# EAGLE schematic PIRprotov1 (EAGLE 7.2.0)
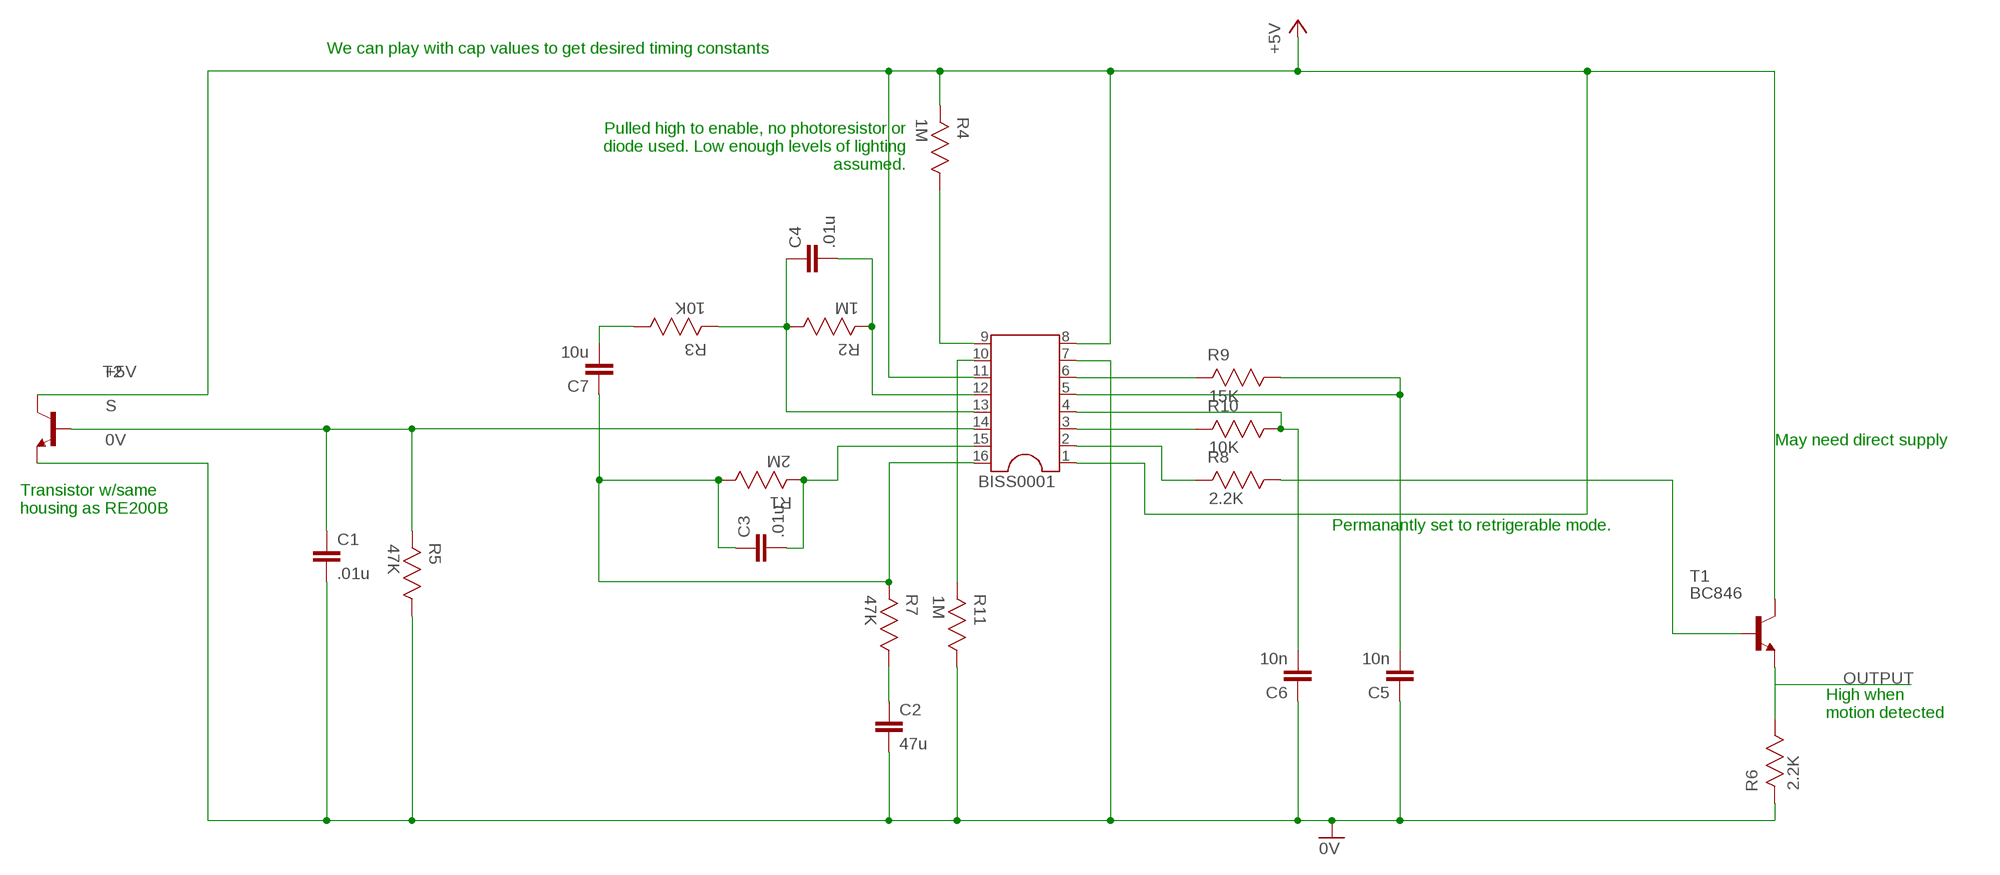
[diagram p0: schematic, sheet 1]

## Parts
BISS0001  DIL16S  [SOCKET-16]
C1  .01u  CAP0805  [0805]
C2  47u  CAP0805  [0805]
C3  .01u  CAP0805  [0805]
C4  .01u  CAP0805  [0805]
C5  10n  CAP0805  [0805]
C6  10n  CAP0805  [0805]
C7  10u  CAP0805  [0805]
R1  2M  0603RESISTOR1  [0603RESISTOR]
R2  1M  0603RESISTOR1  [0603RESISTOR]
R3  10K  0603RESISTOR1  [0603RESISTOR]
R4  1M  0603RESISTOR1  [0603RESISTOR]
R5  47K  0603RESISTOR1  [0603RESISTOR]
R6  2.2K  0603RESISTOR1  [0603RESISTOR]
R7  47K  0603RESISTOR1  [0603RESISTOR]
R8  2.2K  0603RESISTOR1  [0603RESISTOR]
R9  15K  0603RESISTOR1  [0603RESISTOR]
R10  10K  0603RESISTOR1  [0603RESISTOR]
R11  1M  0603RESISTOR1  [0603RESISTOR]
T1  BC846  [SOT23]
T2  -NPN-TO5  [TO5]

## Nets
0V: BISS0001.7 C1.2 C2.2 C5.1 C6.1 R5.1 R6.2 R11.1 T2.1(E)
+5V: BISS0001.1 BISS0001.8 BISS0001.11 R4.2 T1.3(C) T2.3(C)
N$1: BISS0001.16 C3.1 C7.1 R1.1 R7.2
N$2: BISS0001.15 C3.2 R1.2
N$3: C7.2 R3.1
N$4: BISS0001.13 C4.1 R2.1 R3.2
N$5: BISS0001.12 C4.2 R2.2
N$6: BISS0001.6 R9.2
N$7: BISS0001.5 C5.2 R9.1
N$8: C2.1 R7.1
N$9: BISS0001.9 R4.1
N$10: BISS0001.10 R11.2
N$11: BISS0001.4 C6.2 R10.1
N$12: BISS0001.3 R10.2
N$13: BISS0001.2 R8.2
N$15: R8.1 T1.1(B)
OUTPUT: R6.1 T1.2(E)
S: BISS0001.14 C1.1 R5.2 T2.2(B)

## Notes on the sheet
- We can play with cap values to get desired timing constants
- Pulled high to enable, no photoresistor or
   diode used. Low enough levels of lighting
   assumed.
- May need direct supply
- Transistor w/same 
  housing as RE200B
- Permanantly set to retrigerable mode.
- High when 
  motion detected

## Library data of the parts
BISS0001 = ic-package:DIL16: Dual In Line / Socket
C1-C7 = CharlieCreations:CAP: Capacitor Standard 0603 ceramic capacitor, and 0.1" leaded capacitor.
R1-R11 = CharlieCreations:0603RESISTOR: RESISTOR, 0603; MPN: CRCW06031K21FKEA; OC_FARNELL: 1652852; OC_NEWARK: 52K8027; SUPPLIER: Vishay; TOLERANCE: ± 1.0 %; VALUE: 0; WATTAGE: 0.1W
T1 = CharlieCreations:BC846: NPN TRANSISTOR
T2 = transistor:*-NPN-: NPN Transistror BF959 corrected 2008.03.06